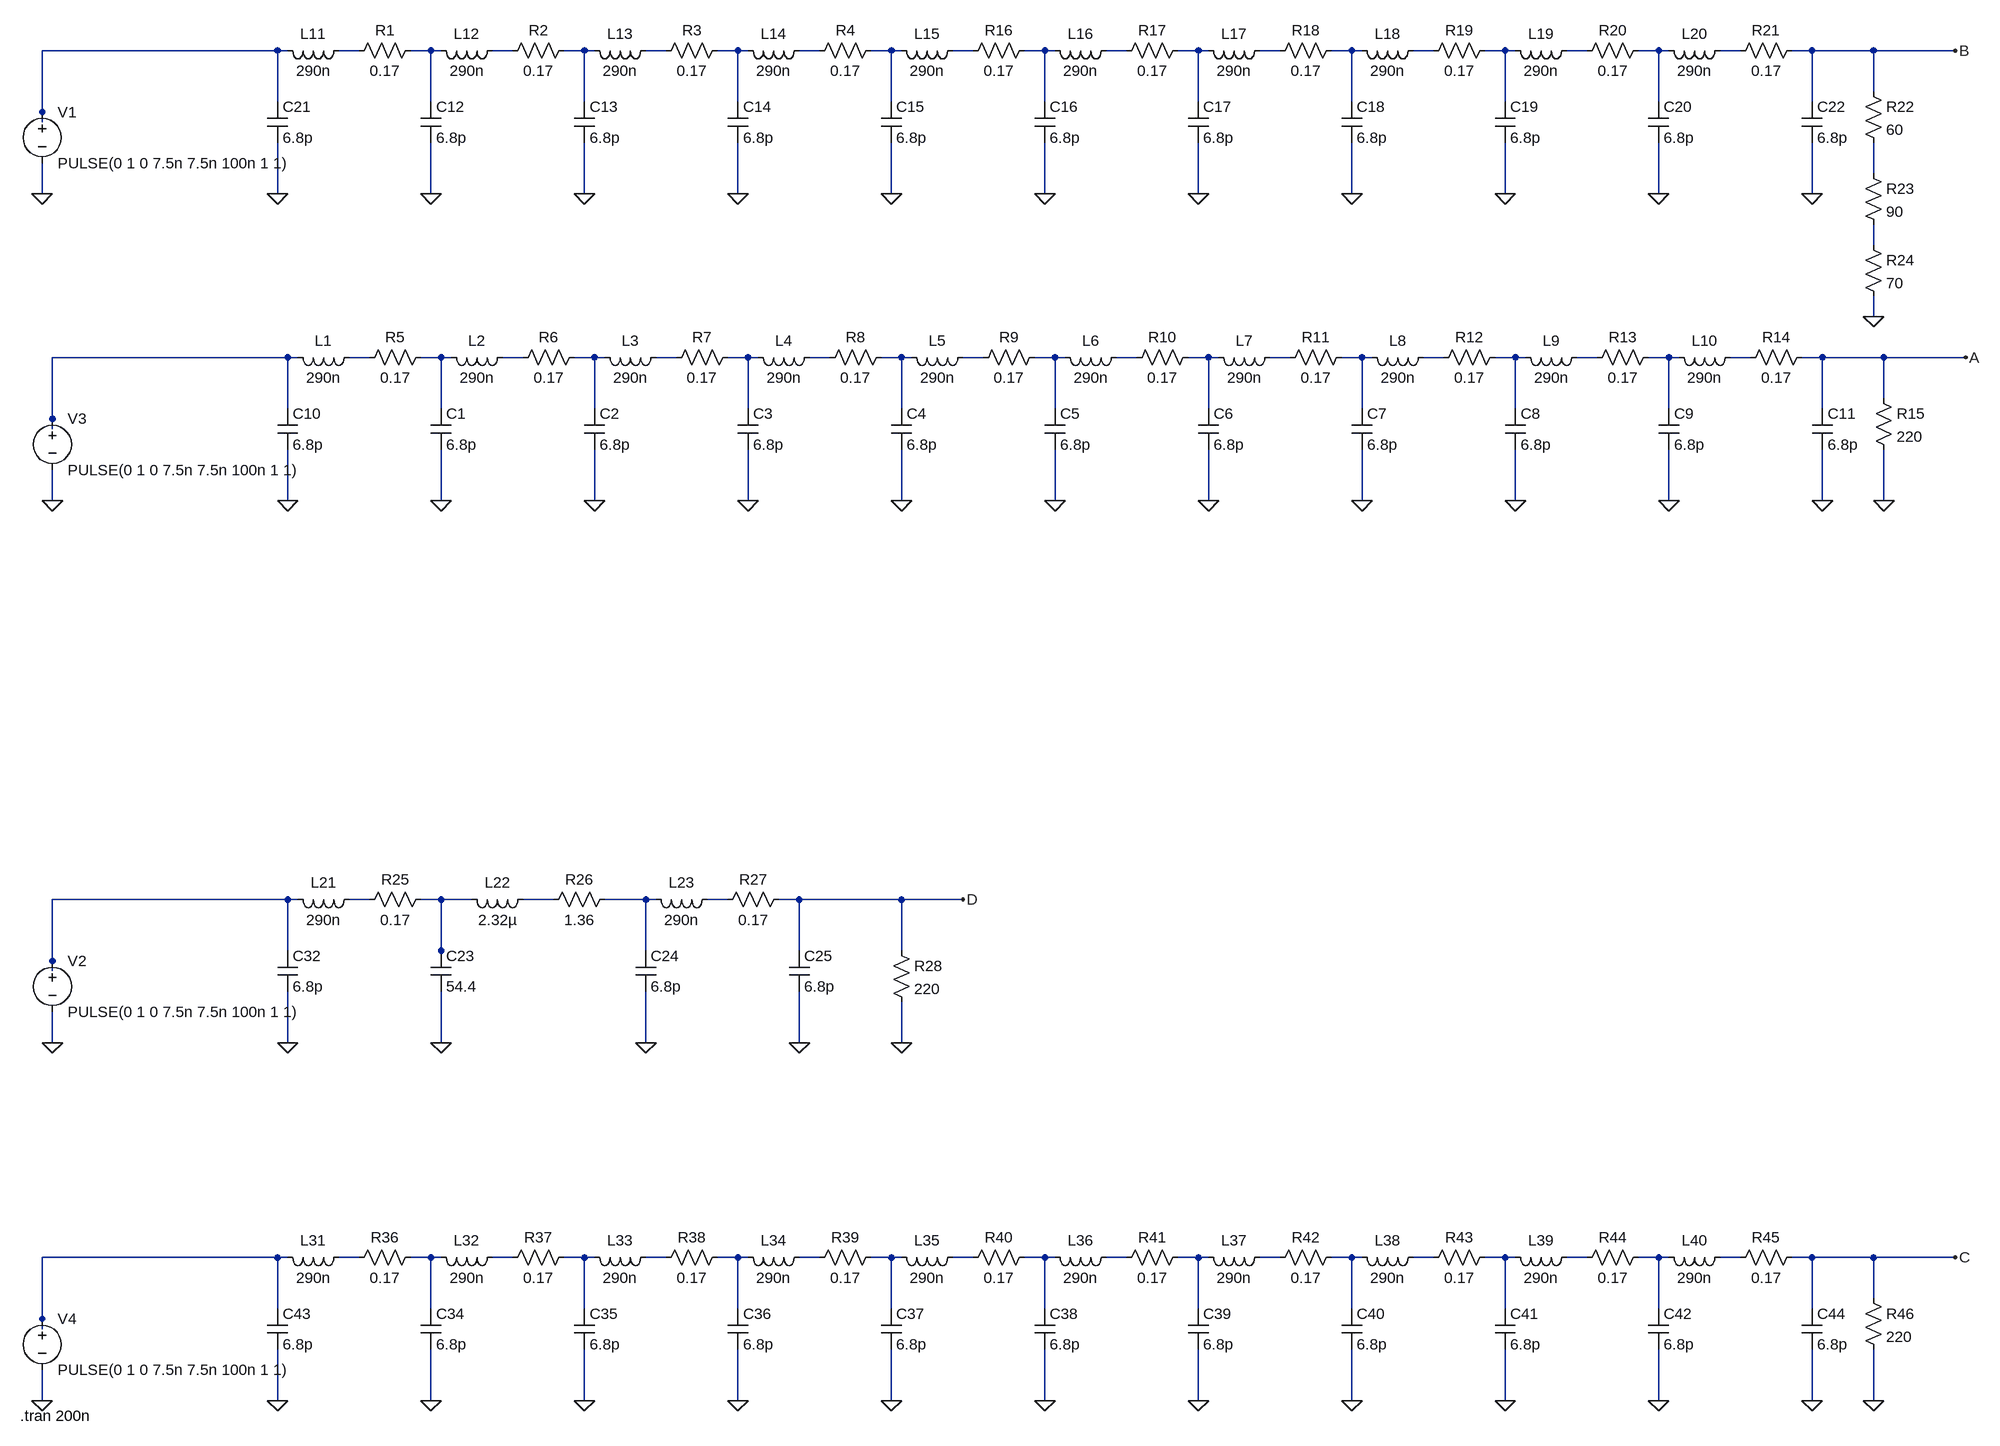
[diagram p0: schematic component_combining_tests.asc]
component_combining_tests.asc, the LTspice schematic file:
Version 4
SHEET 1 1556 1432
WIRE -2032 -720 -2400 -720
WIRE -2016 -720 -2032 -720
WIRE -1904 -720 -1936 -720
WIRE -1792 -720 -1824 -720
WIRE -1776 -720 -1792 -720
WIRE -1664 -720 -1696 -720
WIRE -1552 -720 -1584 -720
WIRE -1536 -720 -1552 -720
WIRE -1424 -720 -1456 -720
WIRE -1312 -720 -1344 -720
WIRE -1296 -720 -1312 -720
WIRE -1184 -720 -1216 -720
WIRE -1072 -720 -1104 -720
WIRE -1056 -720 -1072 -720
WIRE -944 -720 -976 -720
WIRE -832 -720 -864 -720
WIRE -816 -720 -832 -720
WIRE -704 -720 -736 -720
WIRE -592 -720 -624 -720
WIRE -576 -720 -592 -720
WIRE -464 -720 -496 -720
WIRE -352 -720 -384 -720
WIRE -336 -720 -352 -720
WIRE -224 -720 -256 -720
WIRE -112 -720 -144 -720
WIRE -96 -720 -112 -720
WIRE 16 -720 -16 -720
WIRE 128 -720 96 -720
WIRE 144 -720 128 -720
WIRE 256 -720 224 -720
WIRE 368 -720 336 -720
WIRE 464 -720 368 -720
WIRE 592 -720 464 -720
WIRE 464 -656 464 -720
WIRE -2032 -640 -2032 -720
WIRE -1792 -640 -1792 -720
WIRE -1552 -640 -1552 -720
WIRE -1312 -640 -1312 -720
WIRE -1072 -640 -1072 -720
WIRE -832 -640 -832 -720
WIRE -592 -640 -592 -720
WIRE -352 -640 -352 -720
WIRE -112 -640 -112 -720
WIRE 128 -640 128 -720
WIRE 368 -640 368 -720
WIRE -2400 -624 -2400 -720
WIRE -2400 -608 -2400 -624
WIRE 464 -528 464 -576
WIRE -2400 -496 -2400 -544
WIRE -2032 -496 -2032 -576
WIRE -1792 -496 -1792 -576
WIRE -1552 -496 -1552 -576
WIRE -1312 -496 -1312 -576
WIRE -1072 -496 -1072 -576
WIRE -832 -496 -832 -576
WIRE -592 -496 -592 -576
WIRE -352 -496 -352 -576
WIRE -112 -496 -112 -576
WIRE 128 -496 128 -576
WIRE 368 -496 368 -576
WIRE 464 -416 464 -448
WIRE 464 -304 464 -336
WIRE -2016 -240 -2384 -240
WIRE -2000 -240 -2016 -240
WIRE -1888 -240 -1920 -240
WIRE -1776 -240 -1808 -240
WIRE -1760 -240 -1776 -240
WIRE -1648 -240 -1680 -240
WIRE -1536 -240 -1568 -240
WIRE -1520 -240 -1536 -240
WIRE -1408 -240 -1440 -240
WIRE -1296 -240 -1328 -240
WIRE -1280 -240 -1296 -240
WIRE -1168 -240 -1200 -240
WIRE -1056 -240 -1088 -240
WIRE -1040 -240 -1056 -240
WIRE -928 -240 -960 -240
WIRE -816 -240 -848 -240
WIRE -800 -240 -816 -240
WIRE -688 -240 -720 -240
WIRE -576 -240 -608 -240
WIRE -560 -240 -576 -240
WIRE -448 -240 -480 -240
WIRE -336 -240 -368 -240
WIRE -320 -240 -336 -240
WIRE -208 -240 -240 -240
WIRE -96 -240 -128 -240
WIRE -80 -240 -96 -240
WIRE 32 -240 0 -240
WIRE 144 -240 112 -240
WIRE 160 -240 144 -240
WIRE 272 -240 240 -240
WIRE 384 -240 352 -240
WIRE 480 -240 384 -240
WIRE 608 -240 480 -240
WIRE 480 -176 480 -240
WIRE -2016 -160 -2016 -240
WIRE -1776 -160 -1776 -240
WIRE -1536 -160 -1536 -240
WIRE -1296 -160 -1296 -240
WIRE -1056 -160 -1056 -240
WIRE -816 -160 -816 -240
WIRE -576 -160 -576 -240
WIRE -336 -160 -336 -240
WIRE -96 -160 -96 -240
WIRE 144 -160 144 -240
WIRE 384 -160 384 -240
WIRE -2384 -144 -2384 -240
WIRE -2384 -128 -2384 -144
WIRE -2384 -16 -2384 -64
WIRE -2016 -16 -2016 -96
WIRE -1776 -16 -1776 -96
WIRE -1536 -16 -1536 -96
WIRE -1296 -16 -1296 -96
WIRE -1056 -16 -1056 -96
WIRE -816 -16 -816 -96
WIRE -576 -16 -576 -96
WIRE -336 -16 -336 -96
WIRE -96 -16 -96 -96
WIRE 144 -16 144 -96
WIRE 384 -16 384 -96
WIRE 480 -16 480 -96
WIRE -2016 608 -2384 608
WIRE -2000 608 -2016 608
WIRE -1888 608 -1920 608
WIRE -1776 608 -1808 608
WIRE -1728 608 -1776 608
WIRE -1600 608 -1648 608
WIRE -1456 608 -1520 608
WIRE -1440 608 -1456 608
WIRE -1328 608 -1360 608
WIRE -1216 608 -1248 608
WIRE -1056 608 -1216 608
WIRE -960 608 -1056 608
WIRE -2016 688 -2016 608
WIRE -1776 688 -1776 608
WIRE -1456 688 -1456 608
WIRE -1216 688 -1216 608
WIRE -1056 688 -1056 608
WIRE -2384 704 -2384 608
WIRE -1776 704 -1776 688
WIRE -2384 720 -2384 704
WIRE -2384 832 -2384 784
WIRE -2016 832 -2016 752
WIRE -1776 832 -1776 752
WIRE -1456 832 -1456 752
WIRE -1216 832 -1216 752
WIRE -1056 832 -1056 768
WIRE -2032 1168 -2400 1168
WIRE -2016 1168 -2032 1168
WIRE -1904 1168 -1936 1168
WIRE -1792 1168 -1824 1168
WIRE -1776 1168 -1792 1168
WIRE -1664 1168 -1696 1168
WIRE -1552 1168 -1584 1168
WIRE -1536 1168 -1552 1168
WIRE -1424 1168 -1456 1168
WIRE -1312 1168 -1344 1168
WIRE -1296 1168 -1312 1168
WIRE -1184 1168 -1216 1168
WIRE -1072 1168 -1104 1168
WIRE -1056 1168 -1072 1168
WIRE -944 1168 -976 1168
WIRE -832 1168 -864 1168
WIRE -816 1168 -832 1168
WIRE -704 1168 -736 1168
WIRE -592 1168 -624 1168
WIRE -576 1168 -592 1168
WIRE -464 1168 -496 1168
WIRE -352 1168 -384 1168
WIRE -336 1168 -352 1168
WIRE -224 1168 -256 1168
WIRE -112 1168 -144 1168
WIRE -96 1168 -112 1168
WIRE 16 1168 -16 1168
WIRE 128 1168 96 1168
WIRE 144 1168 128 1168
WIRE 256 1168 224 1168
WIRE 368 1168 336 1168
WIRE 464 1168 368 1168
WIRE 592 1168 464 1168
WIRE 464 1232 464 1168
WIRE -2032 1248 -2032 1168
WIRE -1792 1248 -1792 1168
WIRE -1552 1248 -1552 1168
WIRE -1312 1248 -1312 1168
WIRE -1072 1248 -1072 1168
WIRE -832 1248 -832 1168
WIRE -592 1248 -592 1168
WIRE -352 1248 -352 1168
WIRE -112 1248 -112 1168
WIRE 128 1248 128 1168
WIRE 368 1248 368 1168
WIRE -2400 1264 -2400 1168
WIRE -2400 1280 -2400 1264
WIRE -2400 1392 -2400 1344
WIRE -2032 1392 -2032 1312
WIRE -1792 1392 -1792 1312
WIRE -1552 1392 -1552 1312
WIRE -1312 1392 -1312 1312
WIRE -1072 1392 -1072 1312
WIRE -832 1392 -832 1312
WIRE -592 1392 -592 1312
WIRE -352 1392 -352 1312
WIRE -112 1392 -112 1312
WIRE 128 1392 128 1312
WIRE 368 1392 368 1312
WIRE 464 1392 464 1312
FLAG -2384 -16 0
FLAG -2016 -16 0
FLAG -96 -16 0
FLAG 144 -16 0
FLAG 384 -16 0
FLAG 480 -16 0
FLAG 608 -240 A
FLAG -1776 -16 0
FLAG -1536 -16 0
FLAG -1296 -16 0
FLAG -1056 -16 0
FLAG -816 -16 0
FLAG -576 -16 0
FLAG -336 -16 0
FLAG -2400 -496 0
FLAG -2032 -496 0
FLAG -112 -496 0
FLAG 128 -496 0
FLAG 368 -496 0
FLAG 592 -720 B
FLAG -1792 -496 0
FLAG -1552 -496 0
FLAG -1312 -496 0
FLAG -1072 -496 0
FLAG -832 -496 0
FLAG -592 -496 0
FLAG -352 -496 0
FLAG 464 -304 0
FLAG -2384 832 0
FLAG -2016 832 0
FLAG -2400 1392 0
FLAG -2032 1392 0
FLAG -112 1392 0
FLAG 128 1392 0
FLAG 368 1392 0
FLAG 464 1392 0
FLAG 592 1168 C
FLAG -1792 1392 0
FLAG -1552 1392 0
FLAG -1312 1392 0
FLAG -1072 1392 0
FLAG -832 1392 0
FLAG -592 1392 0
FLAG -352 1392 0
FLAG -1776 832 0
FLAG -1456 832 0
FLAG -1216 832 0
FLAG -1056 832 0
FLAG -960 608 D
SYMBOL voltage -2384 -160 R0
WINDOW 123 0 0 Left 0
WINDOW 39 0 0 Left 0
SYMATTR InstName V3
SYMATTR Value PULSE(0 1 0 7.5n 7.5n 100n 1 1)
SYMBOL ind -1904 -256 R90
WINDOW 0 5 56 VBottom 2
WINDOW 3 32 56 VTop 2
SYMATTR InstName L1
SYMATTR Value 290n
SYMBOL res -1792 -256 R90
WINDOW 0 0 56 VBottom 2
WINDOW 3 32 56 VTop 2
SYMATTR InstName R5
SYMATTR Value 0.17
SYMBOL cap -1792 -160 R0
SYMATTR InstName C1
SYMATTR Value 6.8p
SYMBOL ind -1664 -256 R90
WINDOW 0 5 56 VBottom 2
WINDOW 3 32 56 VTop 2
SYMATTR InstName L2
SYMATTR Value 290n
SYMBOL res -1552 -256 R90
WINDOW 0 0 56 VBottom 2
WINDOW 3 32 56 VTop 2
SYMATTR InstName R6
SYMATTR Value 0.17
SYMBOL cap -1552 -160 R0
SYMATTR InstName C2
SYMATTR Value 6.8p
SYMBOL ind -1424 -256 R90
WINDOW 0 5 56 VBottom 2
WINDOW 3 32 56 VTop 2
SYMATTR InstName L3
SYMATTR Value 290n
SYMBOL res -1312 -256 R90
WINDOW 0 0 56 VBottom 2
WINDOW 3 32 56 VTop 2
SYMATTR InstName R7
SYMATTR Value 0.17
SYMBOL cap -1312 -160 R0
SYMATTR InstName C3
SYMATTR Value 6.8p
SYMBOL ind -1184 -256 R90
WINDOW 0 5 56 VBottom 2
WINDOW 3 32 56 VTop 2
SYMATTR InstName L4
SYMATTR Value 290n
SYMBOL res -1072 -256 R90
WINDOW 0 0 56 VBottom 2
WINDOW 3 32 56 VTop 2
SYMATTR InstName R8
SYMATTR Value 0.17
SYMBOL cap -1072 -160 R0
SYMATTR InstName C4
SYMATTR Value 6.8p
SYMBOL ind -944 -256 R90
WINDOW 0 5 56 VBottom 2
WINDOW 3 32 56 VTop 2
SYMATTR InstName L5
SYMATTR Value 290n
SYMBOL res -832 -256 R90
WINDOW 0 0 56 VBottom 2
WINDOW 3 32 56 VTop 2
SYMATTR InstName R9
SYMATTR Value 0.17
SYMBOL cap -832 -160 R0
SYMATTR InstName C5
SYMATTR Value 6.8p
SYMBOL ind -704 -256 R90
WINDOW 0 5 56 VBottom 2
WINDOW 3 32 56 VTop 2
SYMATTR InstName L6
SYMATTR Value 290n
SYMBOL res -592 -256 R90
WINDOW 0 0 56 VBottom 2
WINDOW 3 32 56 VTop 2
SYMATTR InstName R10
SYMATTR Value 0.17
SYMBOL cap -592 -160 R0
SYMATTR InstName C6
SYMATTR Value 6.8p
SYMBOL ind -464 -256 R90
WINDOW 0 5 56 VBottom 2
WINDOW 3 32 56 VTop 2
SYMATTR InstName L7
SYMATTR Value 290n
SYMBOL res -352 -256 R90
WINDOW 0 0 56 VBottom 2
WINDOW 3 32 56 VTop 2
SYMATTR InstName R11
SYMATTR Value 0.17
SYMBOL cap -352 -160 R0
SYMATTR InstName C7
SYMATTR Value 6.8p
SYMBOL ind -224 -256 R90
WINDOW 0 5 56 VBottom 2
WINDOW 3 32 56 VTop 2
SYMATTR InstName L8
SYMATTR Value 290n
SYMBOL res -112 -256 R90
WINDOW 0 0 56 VBottom 2
WINDOW 3 32 56 VTop 2
SYMATTR InstName R12
SYMATTR Value 0.17
SYMBOL cap -112 -160 R0
SYMATTR InstName C8
SYMATTR Value 6.8p
SYMBOL ind 16 -256 R90
WINDOW 0 5 56 VBottom 2
WINDOW 3 32 56 VTop 2
SYMATTR InstName L9
SYMATTR Value 290n
SYMBOL res 128 -256 R90
WINDOW 0 0 56 VBottom 2
WINDOW 3 32 56 VTop 2
SYMATTR InstName R13
SYMATTR Value 0.17
SYMBOL cap 128 -160 R0
SYMATTR InstName C9
SYMATTR Value 6.8p
SYMBOL ind 256 -256 R90
WINDOW 0 5 56 VBottom 2
WINDOW 3 32 56 VTop 2
SYMATTR InstName L10
SYMATTR Value 290n
SYMBOL res 368 -256 R90
WINDOW 0 0 56 VBottom 2
WINDOW 3 32 56 VTop 2
SYMATTR InstName R14
SYMATTR Value 0.17
SYMBOL cap -2032 -160 R0
SYMATTR InstName C10
SYMATTR Value 6.8p
SYMBOL cap 368 -160 R0
SYMATTR InstName C11
SYMATTR Value 6.8p
SYMBOL res 464 -192 R0
SYMATTR InstName R15
SYMATTR Value 220
SYMBOL voltage -2400 -640 R0
WINDOW 123 0 0 Left 0
WINDOW 39 0 0 Left 0
SYMATTR InstName V1
SYMATTR Value PULSE(0 1 0 7.5n 7.5n 100n 1 1)
SYMBOL ind -1920 -736 R90
WINDOW 0 5 56 VBottom 2
WINDOW 3 32 56 VTop 2
SYMATTR InstName L11
SYMATTR Value 290n
SYMBOL res -1808 -736 R90
WINDOW 0 0 56 VBottom 2
WINDOW 3 32 56 VTop 2
SYMATTR InstName R1
SYMATTR Value 0.17
SYMBOL cap -1808 -640 R0
SYMATTR InstName C12
SYMATTR Value 6.8p
SYMBOL ind -1680 -736 R90
WINDOW 0 5 56 VBottom 2
WINDOW 3 32 56 VTop 2
SYMATTR InstName L12
SYMATTR Value 290n
SYMBOL res -1568 -736 R90
WINDOW 0 0 56 VBottom 2
WINDOW 3 32 56 VTop 2
SYMATTR InstName R2
SYMATTR Value 0.17
SYMBOL cap -1568 -640 R0
SYMATTR InstName C13
SYMATTR Value 6.8p
SYMBOL ind -1440 -736 R90
WINDOW 0 5 56 VBottom 2
WINDOW 3 32 56 VTop 2
SYMATTR InstName L13
SYMATTR Value 290n
SYMBOL res -1328 -736 R90
WINDOW 0 0 56 VBottom 2
WINDOW 3 32 56 VTop 2
SYMATTR InstName R3
SYMATTR Value 0.17
SYMBOL cap -1328 -640 R0
SYMATTR InstName C14
SYMATTR Value 6.8p
SYMBOL ind -1200 -736 R90
WINDOW 0 5 56 VBottom 2
WINDOW 3 32 56 VTop 2
SYMATTR InstName L14
SYMATTR Value 290n
SYMBOL res -1088 -736 R90
WINDOW 0 0 56 VBottom 2
WINDOW 3 32 56 VTop 2
SYMATTR InstName R4
SYMATTR Value 0.17
SYMBOL cap -1088 -640 R0
SYMATTR InstName C15
SYMATTR Value 6.8p
SYMBOL ind -960 -736 R90
WINDOW 0 5 56 VBottom 2
WINDOW 3 32 56 VTop 2
SYMATTR InstName L15
SYMATTR Value 290n
SYMBOL res -848 -736 R90
WINDOW 0 0 56 VBottom 2
WINDOW 3 32 56 VTop 2
SYMATTR InstName R16
SYMATTR Value 0.17
SYMBOL cap -848 -640 R0
SYMATTR InstName C16
SYMATTR Value 6.8p
SYMBOL ind -720 -736 R90
WINDOW 0 5 56 VBottom 2
WINDOW 3 32 56 VTop 2
SYMATTR InstName L16
SYMATTR Value 290n
SYMBOL res -608 -736 R90
WINDOW 0 0 56 VBottom 2
WINDOW 3 32 56 VTop 2
SYMATTR InstName R17
SYMATTR Value 0.17
SYMBOL cap -608 -640 R0
SYMATTR InstName C17
SYMATTR Value 6.8p
SYMBOL ind -480 -736 R90
WINDOW 0 5 56 VBottom 2
WINDOW 3 32 56 VTop 2
SYMATTR InstName L17
SYMATTR Value 290n
SYMBOL res -368 -736 R90
WINDOW 0 0 56 VBottom 2
WINDOW 3 32 56 VTop 2
SYMATTR InstName R18
SYMATTR Value 0.17
SYMBOL cap -368 -640 R0
SYMATTR InstName C18
SYMATTR Value 6.8p
SYMBOL ind -240 -736 R90
WINDOW 0 5 56 VBottom 2
WINDOW 3 32 56 VTop 2
SYMATTR InstName L18
SYMATTR Value 290n
SYMBOL res -128 -736 R90
WINDOW 0 0 56 VBottom 2
WINDOW 3 32 56 VTop 2
SYMATTR InstName R19
SYMATTR Value 0.17
SYMBOL cap -128 -640 R0
SYMATTR InstName C19
SYMATTR Value 6.8p
SYMBOL ind 0 -736 R90
WINDOW 0 5 56 VBottom 2
WINDOW 3 32 56 VTop 2
SYMATTR InstName L19
SYMATTR Value 290n
SYMBOL res 112 -736 R90
WINDOW 0 0 56 VBottom 2
WINDOW 3 32 56 VTop 2
SYMATTR InstName R20
SYMATTR Value 0.17
SYMBOL cap 112 -640 R0
SYMATTR InstName C20
SYMATTR Value 6.8p
SYMBOL ind 240 -736 R90
WINDOW 0 5 56 VBottom 2
WINDOW 3 32 56 VTop 2
SYMATTR InstName L20
SYMATTR Value 290n
SYMBOL res 352 -736 R90
WINDOW 0 0 56 VBottom 2
WINDOW 3 32 56 VTop 2
SYMATTR InstName R21
SYMATTR Value 0.17
SYMBOL cap -2048 -640 R0
SYMATTR InstName C21
SYMATTR Value 6.8p
SYMBOL cap 352 -640 R0
SYMATTR InstName C22
SYMATTR Value 6.8p
SYMBOL res 448 -672 R0
SYMATTR InstName R22
SYMATTR Value 60
SYMBOL res 448 -544 R0
SYMATTR InstName R23
SYMATTR Value 90
SYMBOL res 448 -432 R0
SYMATTR InstName R24
SYMATTR Value 70
SYMBOL voltage -2384 688 R0
WINDOW 123 0 0 Left 0
WINDOW 39 0 0 Left 0
SYMATTR InstName V2
SYMATTR Value PULSE(0 1 0 7.5n 7.5n 100n 1 1)
SYMBOL ind -1904 592 R90
WINDOW 0 5 56 VBottom 2
WINDOW 3 32 56 VTop 2
SYMATTR InstName L21
SYMATTR Value 290n
SYMBOL res -1792 592 R90
WINDOW 0 0 56 VBottom 2
WINDOW 3 32 56 VTop 2
SYMATTR InstName R25
SYMATTR Value 0.17
SYMBOL cap -2032 688 R0
SYMATTR InstName C32
SYMATTR Value 6.8p
SYMBOL voltage -2400 1248 R0
WINDOW 123 0 0 Left 0
WINDOW 39 0 0 Left 0
SYMATTR InstName V4
SYMATTR Value PULSE(0 1 0 7.5n 7.5n 100n 1 1)
SYMBOL ind -1920 1152 R90
WINDOW 0 5 56 VBottom 2
WINDOW 3 32 56 VTop 2
SYMATTR InstName L31
SYMATTR Value 290n
SYMBOL res -1808 1152 R90
WINDOW 0 0 56 VBottom 2
WINDOW 3 32 56 VTop 2
SYMATTR InstName R36
SYMATTR Value 0.17
SYMBOL cap -1808 1248 R0
SYMATTR InstName C34
SYMATTR Value 6.8p
SYMBOL ind -1680 1152 R90
WINDOW 0 5 56 VBottom 2
WINDOW 3 32 56 VTop 2
SYMATTR InstName L32
SYMATTR Value 290n
SYMBOL res -1568 1152 R90
WINDOW 0 0 56 VBottom 2
WINDOW 3 32 56 VTop 2
SYMATTR InstName R37
SYMATTR Value 0.17
SYMBOL cap -1568 1248 R0
SYMATTR InstName C35
SYMATTR Value 6.8p
SYMBOL ind -1440 1152 R90
WINDOW 0 5 56 VBottom 2
WINDOW 3 32 56 VTop 2
SYMATTR InstName L33
SYMATTR Value 290n
SYMBOL res -1328 1152 R90
WINDOW 0 0 56 VBottom 2
WINDOW 3 32 56 VTop 2
SYMATTR InstName R38
SYMATTR Value 0.17
SYMBOL cap -1328 1248 R0
SYMATTR InstName C36
SYMATTR Value 6.8p
SYMBOL ind -1200 1152 R90
WINDOW 0 5 56 VBottom 2
WINDOW 3 32 56 VTop 2
SYMATTR InstName L34
SYMATTR Value 290n
SYMBOL res -1088 1152 R90
WINDOW 0 0 56 VBottom 2
WINDOW 3 32 56 VTop 2
SYMATTR InstName R39
SYMATTR Value 0.17
SYMBOL cap -1088 1248 R0
SYMATTR InstName C37
SYMATTR Value 6.8p
SYMBOL ind -960 1152 R90
WINDOW 0 5 56 VBottom 2
WINDOW 3 32 56 VTop 2
SYMATTR InstName L35
SYMATTR Value 290n
SYMBOL res -848 1152 R90
WINDOW 0 0 56 VBottom 2
WINDOW 3 32 56 VTop 2
SYMATTR InstName R40
SYMATTR Value 0.17
SYMBOL cap -848 1248 R0
SYMATTR InstName C38
SYMATTR Value 6.8p
SYMBOL ind -720 1152 R90
WINDOW 0 5 56 VBottom 2
WINDOW 3 32 56 VTop 2
SYMATTR InstName L36
SYMATTR Value 290n
SYMBOL res -608 1152 R90
WINDOW 0 0 56 VBottom 2
WINDOW 3 32 56 VTop 2
SYMATTR InstName R41
SYMATTR Value 0.17
SYMBOL cap -608 1248 R0
SYMATTR InstName C39
SYMATTR Value 6.8p
SYMBOL ind -480 1152 R90
WINDOW 0 5 56 VBottom 2
WINDOW 3 32 56 VTop 2
SYMATTR InstName L37
SYMATTR Value 290n
SYMBOL res -368 1152 R90
WINDOW 0 0 56 VBottom 2
WINDOW 3 32 56 VTop 2
SYMATTR InstName R42
SYMATTR Value 0.17
SYMBOL cap -368 1248 R0
SYMATTR InstName C40
SYMATTR Value 6.8p
SYMBOL ind -240 1152 R90
WINDOW 0 5 56 VBottom 2
WINDOW 3 32 56 VTop 2
SYMATTR InstName L38
SYMATTR Value 290n
SYMBOL res -128 1152 R90
WINDOW 0 0 56 VBottom 2
WINDOW 3 32 56 VTop 2
SYMATTR InstName R43
SYMATTR Value 0.17
SYMBOL cap -128 1248 R0
SYMATTR InstName C41
SYMATTR Value 6.8p
SYMBOL ind 0 1152 R90
WINDOW 0 5 56 VBottom 2
WINDOW 3 32 56 VTop 2
SYMATTR InstName L39
SYMATTR Value 290n
SYMBOL res 112 1152 R90
WINDOW 0 0 56 VBottom 2
WINDOW 3 32 56 VTop 2
SYMATTR InstName R44
SYMATTR Value 0.17
SYMBOL cap 112 1248 R0
SYMATTR InstName C42
SYMATTR Value 6.8p
SYMBOL ind 240 1152 R90
WINDOW 0 5 56 VBottom 2
WINDOW 3 32 56 VTop 2
SYMATTR InstName L40
SYMATTR Value 290n
SYMBOL res 352 1152 R90
WINDOW 0 0 56 VBottom 2
WINDOW 3 32 56 VTop 2
SYMATTR InstName R45
SYMATTR Value 0.17
SYMBOL cap -2048 1248 R0
SYMATTR InstName C43
SYMATTR Value 6.8p
SYMBOL cap 352 1248 R0
SYMATTR InstName C44
SYMATTR Value 6.8p
SYMBOL res 448 1216 R0
SYMATTR InstName R46
SYMATTR Value 220
SYMBOL cap -1792 688 R0
SYMATTR InstName C23
SYMATTR Value 54.4
SYMBOL ind -1632 592 R90
WINDOW 0 5 56 VBottom 2
WINDOW 3 32 56 VTop 2
SYMATTR InstName L22
SYMATTR Value 2.32µ
SYMBOL res -1504 592 R90
WINDOW 0 0 56 VBottom 2
WINDOW 3 32 56 VTop 2
SYMATTR InstName R26
SYMATTR Value 1.36
SYMBOL cap -1472 688 R0
SYMATTR InstName C24
SYMATTR Value 6.8p
SYMBOL ind -1344 592 R90
WINDOW 0 5 56 VBottom 2
WINDOW 3 32 56 VTop 2
SYMATTR InstName L23
SYMATTR Value 290n
SYMBOL res -1232 592 R90
WINDOW 0 0 56 VBottom 2
WINDOW 3 32 56 VTop 2
SYMATTR InstName R27
SYMATTR Value 0.17
SYMBOL cap -1232 688 R0
SYMATTR InstName C25
SYMATTR Value 6.8p
SYMBOL res -1072 672 R0
SYMATTR InstName R28
SYMATTR Value 220
TEXT -2434 1416 Left 2 !.tran 200n

The netlist it stands for:
* component_combining_tests.asc
V3 N023 0 PULSE(0 1 0 7.5n 7.5n 100n 1 1)
L1 N024 N023 290n
R5 N025 N024 0.17
C1 N025 0 6.8p
L2 N026 N025 290n
R6 N027 N026 0.17
C2 N027 0 6.8p
L3 N028 N027 290n
R7 N029 N028 0.17
C3 N029 0 6.8p
L4 N030 N029 290n
R8 N031 N030 0.17
C4 N031 0 6.8p
L5 N032 N031 290n
R9 N033 N032 0.17
C5 N033 0 6.8p
L6 N034 N033 290n
R10 N035 N034 0.17
C6 N035 0 6.8p
L7 N036 N035 290n
R11 N037 N036 0.17
C7 N037 0 6.8p
L8 N038 N037 290n
R12 N039 N038 0.17
C8 N039 0 6.8p
L9 N040 N039 290n
R13 N041 N040 0.17
C9 N041 0 6.8p
L10 N042 N041 290n
R14 A N042 0.17
C10 N023 0 6.8p
C11 A 0 6.8p
R15 A 0 220
V1 N001 0 PULSE(0 1 0 7.5n 7.5n 100n 1 1)
L11 N002 N001 290n
R1 N003 N002 0.17
C12 N003 0 6.8p
L12 N004 N003 290n
R2 N005 N004 0.17
C13 N005 0 6.8p
L13 N006 N005 290n
R3 N007 N006 0.17
C14 N007 0 6.8p
L14 N008 N007 290n
R4 N009 N008 0.17
C15 N009 0 6.8p
L15 N010 N009 290n
R16 N011 N010 0.17
C16 N011 0 6.8p
L16 N012 N011 290n
R17 N013 N012 0.17
C17 N013 0 6.8p
L17 N014 N013 290n
R18 N015 N014 0.17
C18 N015 0 6.8p
L18 N016 N015 290n
R19 N017 N016 0.17
C19 N017 0 6.8p
L19 N018 N017 290n
R20 N019 N018 0.17
C20 N019 0 6.8p
L20 N020 N019 290n
R21 B N020 0.17
C21 N001 0 6.8p
C22 B 0 6.8p
R22 B N021 60
R23 N021 N022 90
R24 N022 0 70
V2 N043 0 PULSE(0 1 0 7.5n 7.5n 100n 1 1)
L21 N044 N043 290n
R25 N045 N044 0.17
C32 N043 0 6.8p
V4 N049 0 PULSE(0 1 0 7.5n 7.5n 100n 1 1)
L31 N050 N049 290n
R36 N051 N050 0.17
C34 N051 0 6.8p
L32 N052 N051 290n
R37 N053 N052 0.17
C35 N053 0 6.8p
L33 N054 N053 290n
R38 N055 N054 0.17
C36 N055 0 6.8p
L34 N056 N055 290n
R39 N057 N056 0.17
C37 N057 0 6.8p
L35 N058 N057 290n
R40 N059 N058 0.17
C38 N059 0 6.8p
L36 N060 N059 290n
R41 N061 N060 0.17
C39 N061 0 6.8p
L37 N062 N061 290n
R42 N063 N062 0.17
C40 N063 0 6.8p
L38 N064 N063 290n
R43 N065 N064 0.17
C41 N065 0 6.8p
L39 N066 N065 290n
R44 N067 N066 0.17
C42 N067 0 6.8p
L40 N068 N067 290n
R45 C N068 0.17
C43 N049 0 6.8p
C44 C 0 6.8p
R46 C 0 220
C23 N045 0 54.4
L22 N046 N045 2.32µ
R26 N047 N046 1.36
C24 N047 0 6.8p
L23 N048 N047 290n
R27 D N048 0.17
C25 D 0 6.8p
R28 D 0 220
.tran 200n
.backanno
.end